# Altium schematic sheet DEBUG_UART_INTERFACE.SchDoc
size A4; SheetNumber: 19; SheetTotal: 27
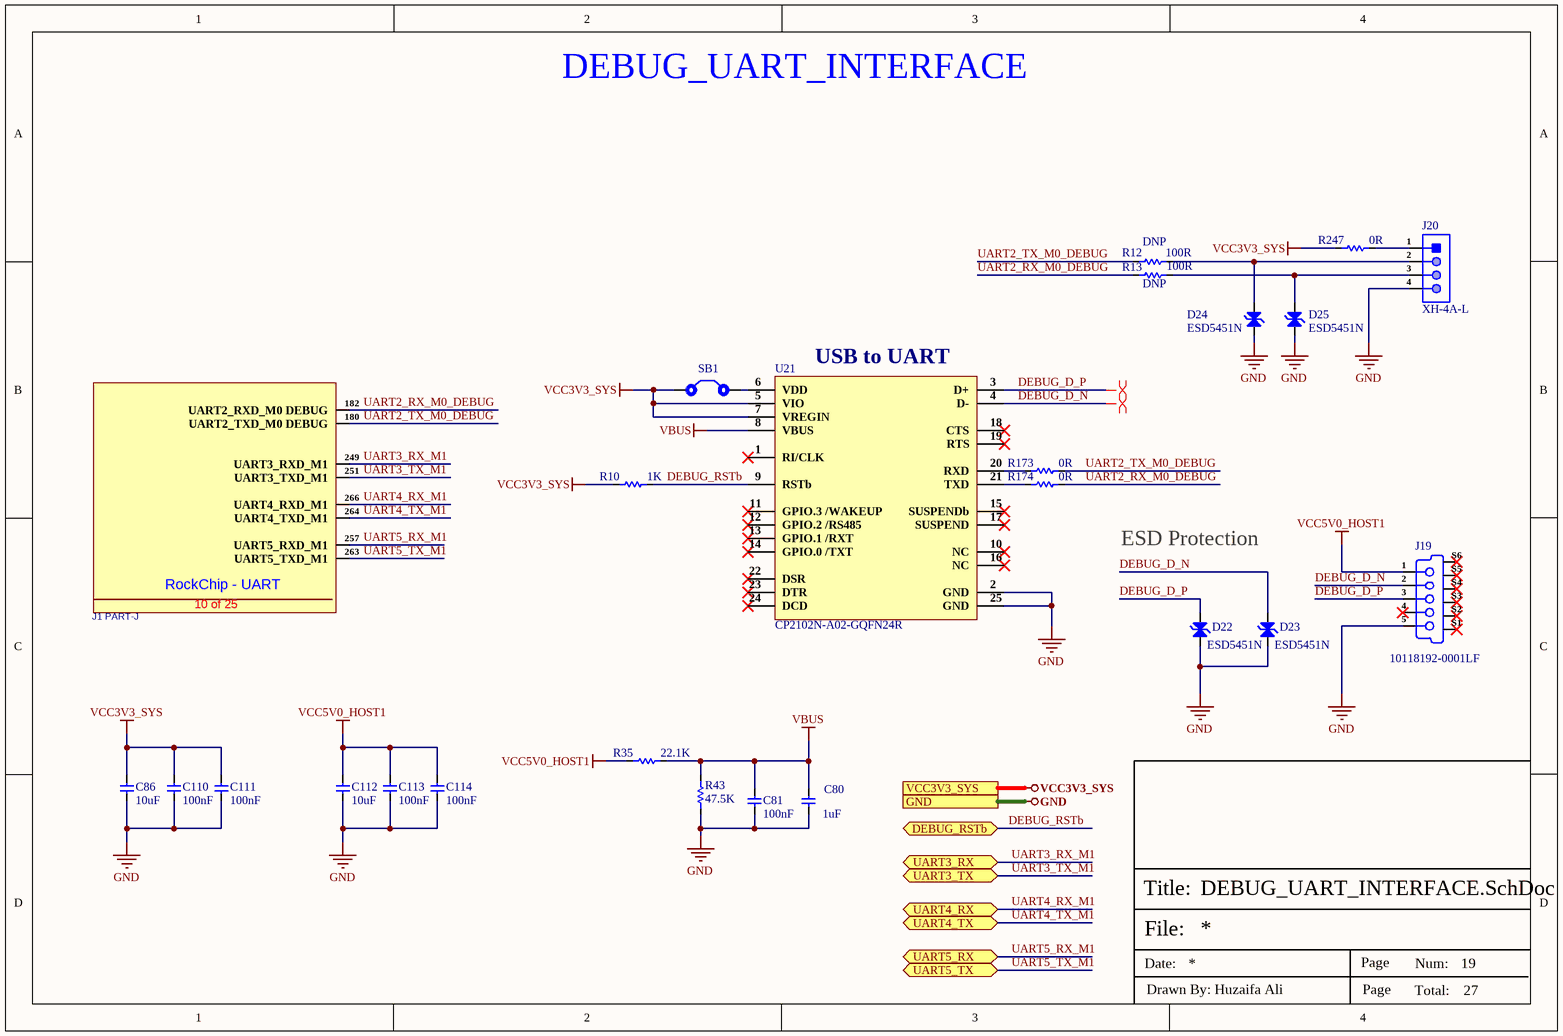
[diagram p0: DEBUG_UART_INTERFACE.SchDoc]

## Parts
C80  1uF  [Cap-0402]
C81  100nF  [Cap-0402]
C86  10uF  [Cap-0603]
C110  100nF  [Cap-0402]
C111  100nF  [Cap-0402]
C112  10uF  [Cap-0603]
C113  100nF  [Cap-0402]
C114  100nF  [Cap-0402]
D22  ESD5451N  [DFN1006-2L (Bi-Directional)]
D23  ESD5451N  [DFN1006-2L (Bi-Directional)]
D24  ESD5451N  [DFN1006-2L (Bi-Directional)]
D25  ESD5451N  [DFN1006-2L (Bi-Directional)]
J1_PART-  AS0B826-S78B-7H  [AS0B826-S78B-7H]  (value not drawn)  (part J of 25)
J19  10118192-0001LF  [10118192-0001LF_]
J20  XH-4A-L  [XH-4A-L]
R10  1K  [Res-0402]
R12  DNP  [Res-0402]
R13  DNP  [Res-0402]
R35  22.1K  [Res-0603]
R43  47.5K  [Res-0603]
R173  0R  [Res-0402]
R174  0R  [Res-0402]
R247  0R  [Res-0402]
SB1  Solder Bridge 0402  [Solder Bridge 0402]  (value not drawn)  (no BOM)
U21  CP2102N-A02-GQFN24R  [CP2102N-A02-GQFN24R]

## Ports
DEBUG_RSTb (bidir, see TOP SHEET[2D], ROCKCHIP_GPIO_NC PINS[3D]), GND (see TOP SHEET[2D], AUDIO_INTERFACE[1D], BUCK REGULATOR[3D], DIGITAL IO_RELAY_SHEET[5D], DUAL_SIM_INTERFACE[3D], ETHERNET_PHY0[4D], ETHERNET_PHY1[4D], GSM_INTERFACE[2D], HDMI_INTERFACE[3D], INPUT_PROTECTION[3D], LINEAR_VOLTAGE_REG[3D], MICRO_SD_INTERFACE[3D], MIPI-DSI DISPLAY[3D], POWER SECTION[3D], PUSH BUTTONs_INTERFACE[3C], RGB_LEDs_INTERFACE[3D], ROCKCHIP_PWR_SUPPLY[1D], ROCKCHIP_SYSTEM_CONTROL[3C], RS232_RS485_INTERFACE[3C], SENSOR_SHEET[3D], USB2.0_INTERFACE[3D], USB3.0_INTERFACE[3D], USB-C_INTERFACE[2D], WIEGAND_INTERFACE[3D], WIFI_BLUETOOTH_SHEET[4C]), UART3_RX (bidir, see TOP SHEET[2D], RS232_RS485_INTERFACE[3D]), UART3_TX (bidir, see TOP SHEET[2D], RS232_RS485_INTERFACE[3D]), UART4_RX (bidir, see TOP SHEET[2D], RS232_RS485_INTERFACE[3D]), UART4_TX (bidir, see TOP SHEET[2D], RS232_RS485_INTERFACE[3D]), UART5_RX (bidir, see TOP SHEET[2D], GSM_INTERFACE[3C]), UART5_TX (bidir, see TOP SHEET[2D], GSM_INTERFACE[3D]), VCC3V3_SYS (see TOP SHEET[2D], AUDIO_INTERFACE[1D], BUCK REGULATOR[3D], DIGITAL IO_RELAY_SHEET[5D], ETHERNET_PHY0[4D], ETHERNET_PHY1[4D], GSM_INTERFACE[2D], HDMI_INTERFACE[3D], LINEAR_VOLTAGE_REG[3D], MIPI-DSI DISPLAY[3D], POWER SECTION[3D], PUSH BUTTONs_INTERFACE[3C], ROCKCHIP_PWR_SUPPLY[1D], ROCKCHIP_SYSTEM_CONTROL[3C], RS232_RS485_INTERFACE[3C], SENSOR_SHEET[3D], USB-C_INTERFACE[2D], WIEGAND_INTERFACE[3D], WIFI_BLUETOOTH_SHEET[4C])

## Nets
GND: C80.2 C81.2 C86.1 C110.1 C111.1 C112.1 C113.1 C114.1 D22.1(K) D23.1(K) D24.1(K) D25.1(K) J19.5(GND) J20.4 R43.2 U21.2(GND) U21.25(GND) ; port GND
VBUS: C80.1 C81.1 R35.2 R43.1 U21.8(VBUS)
VCC3V3_SYS: C86.2 C110.2 C111.2 R10.1 R247.1 SB1.1 U21.5(VIO) U21.7(VREGIN) ; port VCC3V3_SYS
VCC5V0_HOST1: C112.2 C113.2 C114.2 J19.1(V_BUS_(5V)) R35.1
DEBUG_D_N: D23.2(K) J19.2(D-) U21.4(D-)
DEBUG_D_P: D22.2(K) J19.3(D+) U21.3(D+)
DEBUG_RSTb: R10.2 U21.9(RSTb) ; port DEBUG_RSTb
UART2_RX_M0_DEBUG: J1_PART-.182(UART2_RXD_M0_DEBUG) R13.1 R174.2
UART2_TX_M0_DEBUG: J1_PART-.180(UART2_TXD_M0_DEBUG) R12.1 R173.2
UART3_RX_M1: J1_PART-.249(UART3_RXD_M1) ; port UART3_RX
UART3_TX_M1: J1_PART-.251(UART3_TXD_M1) ; port UART3_TX
UART4_RX_M1: J1_PART-.266(UART4_RXD_M1) ; port UART4_RX
UART4_TX_M1: J1_PART-.264(UART4_TXD_M1) ; port UART4_TX
UART5_RX_M1: J1_PART-.257(UART5_RXD_M1) ; port UART5_RX
UART5_TX_M1: J1_PART-.263(UART5_TXD_M1) ; port UART5_TX
NetD24_2: D24.2(K) J20.2 R12.2
NetD25_2: D25.2(K) J20.3 R13.2
NetJ20_1: J20.1 R247.2
NetR173_1: R173.1 U21.20(RXD)
NetR174_1: R174.1 U21.21(TXD)
NetSB1_2: SB1.2 U21.6(VDD)

Not connected (* = marked no-connect by the designer): J19 4(NC)* S1(Shield)* S2(Shield)* S3(Shield)* S4(Shield)* S5(Shield)* S6(Shield)*; U21 1(RI/CLK)* 10(NC)* 11(GPIO.3_/WAKEUP)* 12(GPIO.2_/RS485)* 13(GPIO.1_/RXT)* 14(GPIO.0_/TXT)* 15(SUSPENDb)* 16(NC)* 17(SUSPEND)* 18(CTS)* 19(RTS)* 22(DSR)* 23(DTR)* 24(DCD)*

## Layout directives
differential pair; differential pair class D1_Lines; net class D1: DEBUG_D_P
differential pair; net class D1; differential pair class D1_Lines: DEBUG_D_N

## Notes on the sheet
- DEBUG_UART_INTERFACE
- (near R12) 100R
- 100R
- (near U21) USB to UART
- ESD Protection
- File:
- Title:
- Date:
- Page
- Num:
- Total:
- Drawn By: Huzaifa Ali
- (in symbol AS0B826-S78B-7H, part J) RockChip - UART; 10 of 25

## Library data of the parts
C80 = CC0402KRX5R8BB105: CAP CER 1UF 25V X5R 0402; Manufacturer: Yageo; Tolerance: 10%; Supplier 1: Mouser; Manufacturer Part Number: CC0402KRX5R8BB105; RoHS: Yes; Category: Ceramic Capacitors; Stock 1: 91975; Pricing 1: 1=0.30000, 10=0.20400, 50=0.20400, 100=0.11600, 1000=0.07200, 10000=0.05900 (USD); Mount: Surface Mount; Case/Package: 0402; Case Code (Metric): 1005; Case Code (Imperial): 0402; Min Operating Temperature: -55°C; Max Operating Temperature: 85°C; Capacitance: 1uF; Dielectric: X5R; Package Quantity: 10000; Voltage Rating: 25V; Packaging: Tape and Reel; Termination: SMD/SMT; Voltage Rating (DC): 25V; Length: 0.039inch; Width: 0.02inch; Thickness: 0.022inch; Lead Free: Lead Free; Halogen Free: Halogen Free; RoHS Compliant: Yes; ComponentLink1URL: http://www.mouser.com/ds/2/447/Yageo_UPY-GP_NP0_16V-to-50V_9-358835.pdf?src-supplier=Mouser; ComponentLink1Description: http://www.mouser.com/ds/2/447/Yageo_UPY-GP_NP0_16V-to-50V_9-358835.pdf?src-supplier=Mouser; ComponentLink2URL: http://www.yageo.com/documents/recent/UPY-GPHC_X5R_4V-to-50V_25.pdf?src-supplier=Digi-Key; ComponentLink2Description: http://www.yageo.com/documents/recent/UPY-GPHC_X5R_4V-to-50V_25.pdf?src-supplier=Digi-Key; ComponentLink3URL: https://4donline.ihs.com/images/VipMasterIC/IC/YAGO/YAGO-S-A0006851646/YAGO-S-A0006851646-1.pdf?hkey=6D3A4C79FDBF58556ACFDE234799DDF0&src-supplier=Newark; ComponentLink3Description: https://4donline.ihs.com/images/VipMasterIC/IC/YAGO/YAGO-S-A0006851646/YAGO-S-A0006851646-1.pdf?hkey=6D3A4C79FDBF58556ACFDE234799DDF0&src-supplier=Newark; Supplier Part Number 1: 603-CC402KRX5R8BB105; LCSC Part Number: C326568; Weight: 2.3E-05oz
C81 C110 C111 C113 C114 = CC0402KRX5R7BB104: CAP CER 0.1UF 16V X5R 0402; Manufacturer: Yageo; Tolerance: 10%; Manufacturer Part Number: CC0402KRX5R7BB104; RoHS: Yes; Category: Ceramic Capacitors; Supplier 1: Mouser; Stock 1: 936792; Pricing 1: 1=0.10000, 10=0.02300, 50=0.02300, 100=0.01100, 1000=0.00600, 10000=0.00400 (USD); Mount: Surface Mount; Case/Package: 0402; Number of Pins: 2; Case Code (Metric): 1005; Case Code (Imperial): 0402; Min Operating Temperature: -55°C; Max Operating Temperature: 85°C; Capacitance: 100nF; Dielectric: X5R; Packaging: Tape and Reel; Voltage Rating: 16V; Package Quantity: 1; Voltage Rating (DC): 16V; Termination: SMD/SMT; Resistor Type: Ceramic; Series: CC; Construction: Flat; Length: 1mm; Width: 0.02inch; Height: 0.5mm; Thickness: 0.022inch; Depth: 0.5mm; Radiation Hardening: No; REACH SVHC: Unknown; Lead Free: Lead Free; Halogen Free: Halogen Free; RoHS Compliant: Yes; ComponentLink1URL: https://datasheet.ciiva.com/155/mlccorderingcode-155879.pdf?src-supplier=Digi-Key; ComponentLink1Description: https://datasheet.ciiva.com/155/mlccorderingcode-155879.pdf?src-supplier=Digi-Key; ComponentLink2URL: https://datasheet.ciiva.com/155/mlccorderingcode-155878.pdf?src-supplier=Digi-Key; ComponentLink2Description: https://datasheet.ciiva.com/155/mlccorderingcode-155878.pdf?src-supplier=Digi-Key; ComponentLink3URL: https://datasheet.ciiva.com/155/mlccorderingcode-155880.pdf?src-supplier=Digi-Key; ComponentLink3Description: https://datasheet.ciiva.com/155/mlccorderingcode-155880.pdf?src-supplier=Digi-Key; ComponentLink4URL: https://datasheet.ciiva.com/11464/upy-gphc-x5r-4v-to-50v-12-11464869.pdf?src-supplier=Avnet; ComponentLink4Description: https://datasheet.ciiva.com/11464/upy-gphc-x5r-4v-to-50v-12-11464869.pdf?src-supplier=Avnet; Supplier Part Number 1: 603-CC402KRX5R7BB104; LCSC Part Number: C106204
C86 C112 = C1608X5R1E106M080AC: CAP CER 10UF 25V X5R 0603; Manufacturer: TDK; Tolerance: 20%; Dielectric Material: Ceramic; Item Type: Capacitor; Manufacturer Part Number: C1608X5R1E106M080AC; Supplier 1: Digi-Key; Stock 1: 61681; Pricing 1: 1=0.96, 10=0.704, 100=0.483, 500=0.38238, 1000=0.322 (USD); Mount: Surface Mount; Case/Package: 0603; Case Code (Metric): 1608; Case Code (Imperial): 0603; Min Operating Temperature: -55°C; Max Operating Temperature: 85°C; Capacitance: 10uF; Dielectric: X5R; Packaging: Tape and Reel; Voltage Rating: 25V; Package Quantity: 1; Voltage Rating (DC): 25V; Termination: SMD/SMT; Length: 1.6mm; Width: 0.8mm; Height: 0.8mm; Thickness: 0.039inch; Depth: 0.8mm; REACH SVHC: No SVHC; Lead Free: Lead Free; Supplier Part Number 1: 445-9015-1-ND; LCSC Part Number: C2168289; Weight: 7.1E-05oz; Composition: Ceramic
D22-D25 = ESD5451N: DFN1006-2(0402) ESD Protection Devices ROHS; Manufacturer: TECH PUBLIC; Manufacturer Part Number: ESD5451N; Footprint: DFN1006-2(0402); ComponentLink1Description: LCSC; ComponentLink1URL: https://www.lcsc.com/product-detail/span-style-background-color-ff0-ESD-span-Protection-Devices_TECH-PUBLIC-ESD5451N_C2936977.html; LCSC Part Number: C2936977
J1_PART- = AS0B826-S78B-7H: SMD,P=0.5mm,Surface Mount，Right Angle; Manufacturer: FOXCONN; Item Type: Card Edge Connectors; Supplier: LCSC; Manufacturer Part Number: AS0B826-S78B-7H; RoHS: No; Stock: 4979; Pricing: 1=9.21, 10=8.287, 25=7.8064, 50=7.6064, 100=7.4062 (USD); LCSC Part Number: C426232
J19 = 10118192-0001LF: CONN RCPT USB2.0 MICRO B SMD R/A; Manufacturer: Amphenol FCI; Gender: Receptacle; Current Rating: 1.8A; Connector Type: USB,Receptacle; Number of Contacts: 5; Number of Ports: 1; Insulation Resistance: 1GR; Max Voltage Rating (AC): 100V; Pitch: 0.65mm; Item Type: USB Connector; Supplier 1: Digi-Key; Manufacturer Part Number: 10118192-0001LF; Stock 1: 32977; Pricing 1: 1=0.43, 10=0.405, 25=0.3648, 50=0.3242, 100=0.3107, 250=0.28368, 500=0.27016 (USD); Mount: Surface Mount,Horizontal; Contact Plating: Gold; Contact Material: Copper Alloy; Color: Black; Number of Terminals: 5; Housing Material: Polymer; Min Operating Temperature: -55°C; Max Operating Temperature: 85°C; Termination: Solder; Packaging: Tape and Reel; Orientation: Right Angle; Package Quantity: 1400; Features: Shielded; Voltage Rating: 100V; USB Standard: USB 2.0; Length: 7.86mm; Depth: 5.57mm; Radiation Hardening: No; Flammability Rating: UL94 V-0; Lead Free: Lead Free; REACH SVHC: No SVHC; ComponentLink1URL: https://cdn.amphenol-icc.com/media/wysiwyg/files/documentation/datasheet/inputoutput/io_usb_micro.pdf?src-supplier=Verical; ComponentLink1Description: https://cdn.amphenol-icc.com/media/wysiwyg/files/documentation/datasheet/inputoutput/io_usb_micro.pdf?src-supplier=Verical; ComponentLink2URL: http://www.amphenol-icc.com/media/wysiwyg/files/drawing/10118192.pdf?src-supplier=Digi-Key; ComponentLink2Description: http://www.amphenol-icc.com/media/wysiwyg/files/drawing/10118192.pdf?src-supplier=Digi-Key; ComponentLink3URL: https://cdn.amphenol-icc.com/media/wysiwyg/files/documentation/datasheet/inputoutput/io_usb_micro.pdf?src-supplier=Mouser; ComponentLink3Description: https://cdn.amphenol-icc.com/media/wysiwyg/files/documentation/datasheet/inputoutput/io_usb_micro.pdf?src-supplier=Mouser; Supplier Part Number 1: 609-4613-6-ND; LCSC Part Number: C132564
J20 = XH-4A-L: 1x4P 4P XH 1 Tin 2.5mm 4 -25℃~+85℃ Brass 3A Straight Plugin,P=2.5mm Wire To Board Connector ROHS; Manufacturer: HCTL; Manufacturer Part Number: XH-4A-L; Package: Plugin,P=2.5mm; LCSC Part Number: C2979569; Item Type: Wire To Board Connector; ComponentLink1Description: LCSC; ComponentLink1URL: https://www.lcsc.com/product-detail/Wire-To-Board-Connector_HCTL-XH-4A-L_C2979569.html
R10 = RC0402FR-071KL: RES 1K OHM 1% 1/16W 0402; Manufacturer: Yageo; Resistance: 1kR; Temperature Coefficient: 100ppm/°C; Voltage Rating (DC): 50V; Power Rating: 62.5mW; Max Power Dissipation: 63mW; Item Type: Resistor; Supplier 1: Avnet; Manufacturer Part Number: RC0402FR-071KL; RoHS: Yes; Category: Chip SMD Resistors; Stock 1: 13030000; Pricing 1: 10000=0.00085, 20000=0.00087, 40000=0.00084, 60000=0.00083, 80000=0.00079, 100000=0.00078, 1000000=0.00076 (USD); Case/Package: 0402; Number of Pins: 2; Case Code (Imperial): 0402; Case Code (Metric): 1005; Size Code: 0402; Min Operating Temperature: -55°C; Max Operating Temperature: 155°C; Resistor Type: Thick Film; Tolerance: 1%; Packaging: Tape and Reel; Voltage Rating: 50V; Termination: SMD/SMT; Features: Moisture Resistant; Series: RC; Number of Terminations: 2; Resistance Tolerance: 1%; Construction: Rectangular; Technology: THICK FILM; Length: 1mm; Width: 0.5mm; Height: 0.32mm; Depth: 0.5mm; Reach SVHC Compliant: Yes; Lead Free: Lead Free; RoHS Compliant: Yes; Military Standard: Not; ComponentLink1URL: https://datasheet.ciiva.com/11819/0900766b80c66297-11819477.pdf?src-supplier=RSComponents; ComponentLink1Description: https://datasheet.ciiva.com/11819/0900766b80c66297-11819477.pdf?src-supplier=RSComponents; ComponentLink2URL: https://datasheet.ciiva.com/7983/1018594-7983502.pdf?src-supplier=Element14; ComponentLink2Description: https://datasheet.ciiva.com/7983/1018594-7983502.pdf?src-supplier=Element14; ComponentLink3URL: https://datasheet.ciiva.com/22747/1018594-22747513.pdf?src-supplier=Element14; ComponentLink3Description: https://datasheet.ciiva.com/22747/1018594-22747513.pdf?src-supplier=Element14; ComponentLink4URL: https://datasheet.ciiva.com/12666/pyu-rc0402-51-rohs-l-6-r-12666741.pdf?src-supplier=Mouser; ComponentLink4Description: https://datasheet.ciiva.com/12666/pyu-rc0402-51-rohs-l-6-r-12666741.pdf?src-supplier=Mouser; ComponentLink5URL: https://datasheet.ciiva.com/7849/1018594-7849869.pdf?src-supplier=Element14; ComponentLink5Description: https://datasheet.ciiva.com/7849/1018594-7849869.pdf?src-supplier=Element14; ComponentLink6URL: https://datasheet.ciiva.com/7849/1018594-7849871.pdf?src-supplier=Element14; ComponentLink6Description: https://datasheet.ciiva.com/7849/1018594-7849871.pdf?src-supplier=Element14; ComponentLink7URL: https://datasheet.ciiva.com/17063/pyu-rc0402-51-rohs-l-6-r-17063193.pdf?src-supplier=Future+Electronics; ComponentLink7Description: https://datasheet.ciiva.com/17063/pyu-rc0402-51-rohs-l-6-r-17063193.pdf?src-supplier=Future+Electronics; Supplier Part Number 1: RC0402FR-071KL; LCSC Part Number: C106235
R12 R13 = RC0402FR-07100RL: RES 100 OHM 1% 1/16W 0402; Manufacturer: Yageo; Power Rating: 62.5mW; Voltage Rating: 50V; Resistance: 100R; Temperature Coefficient: 100ppm/°C; Max Power Dissipation: 63mW; Item Type: Resistor; Supplier 1: Mouser; Manufacturer Part Number: RC0402FR-07100RL; RoHS: Yes; Category: Chip SMD Resistors; Stock 1: 699545; Pricing 1: 1=0.10000, 10=0.01200, 50=0.01200, 100=0.00500, 1000=0.00300, 2500=0.00200, 10000=0.00100 (USD); Case/Package: 0402; Number of Pins: 2; Case Code (Imperial): 0402; Case Code (Metric): 1005; Size Code: 0402; Min Operating Temperature: -55°C; Max Operating Temperature: 155°C; Tolerance: 1%; Voltage Rating (DC): 50V; Packaging: Tape and Reel; Termination: SMD/SMT; Resistor Type: Thick Film; Features: Moisture Resistant; Series: RC; Number of Terminations: 2; Resistance Tolerance: 1%; Construction: Rectangular; Technology: THICK FILM; Length: 1mm; Width: 0.5mm; Height: 0.32mm; Depth: 0.5mm; RoHS Compliant: Yes; REACH SVHC: No SVHC; Military Standard: Not; Lead Free: Lead Free; ComponentLink1URL: https://datasheet.ciiva.com/11808/0900766b80c66297-11808765.pdf?src-supplier=RSComponents; ComponentLink1Description: https://datasheet.ciiva.com/11808/0900766b80c66297-11808765.pdf?src-supplier=RSComponents; ComponentLink2URL: https://datasheet.ciiva.com/7849/1784430-7849810.pdf?src-supplier=Element14; ComponentLink2Description: https://datasheet.ciiva.com/7849/1784430-7849810.pdf?src-supplier=Element14; ComponentLink3URL: https://datasheet.ciiva.com/28367/1018594-28367226.pdf?src-supplier=Element14; ComponentLink3Description: https://datasheet.ciiva.com/28367/1018594-28367226.pdf?src-supplier=Element14; ComponentLink4URL: https://datasheet.ciiva.com/22747/1018594-22747511.pdf?src-supplier=Element14; ComponentLink4Description: https://datasheet.ciiva.com/22747/1018594-22747511.pdf?src-supplier=Element14; ComponentLink5URL: https://datasheet.ciiva.com/12667/pyu-rc0402-51-rohs-l-6-r-12667957.pdf?src-supplier=Mouser; ComponentLink5Description: https://datasheet.ciiva.com/12667/pyu-rc0402-51-rohs-l-6-r-12667957.pdf?src-supplier=Mouser; ComponentLink6URL: https://datasheet.ciiva.com/15189/getdatasheetpartid-329466-15189335.pdf?src-supplier=Verical; ComponentLink6Description: https://datasheet.ciiva.com/15189/getdatasheetpartid-329466-15189335.pdf?src-supplier=Verical; ComponentLink7URL: https://datasheet.ciiva.com/16740/pyu-rc0402-51-rohs-l-6-r-16740566.pdf?src-supplier=Future+Electronics; ComponentLink7Description: https://datasheet.ciiva.com/16740/pyu-rc0402-51-rohs-l-6-r-16740566.pdf?src-supplier=Future+Electronics; Supplier Part Number 1: 603-RC0402FR-07100RL; LCSC Part Number: C106232
R35 = RC0603FR-0722K1L: RES 22.1K OHM 1% 1/10W 0603; Manufacturer: Yageo; Power Rating: 100mW; Resistance: 22.1kR; Voltage Rating: 50V; Temperature Coefficient: 100ppm/°C; Item Type: Resistor; Supplier 1: Avnet; Manufacturer Part Number: RC0603FR-0722K1L; RoHS: Yes; Category: Chip SMD Resistors; Stock 1: 595000; Pricing 1: 5000=0.00133, 10000=0.00131, 20000=0.00127 (USD); Case/Package: 0603; Case Code (Imperial): 0603; Case Code (Metric): 1608; Size Code: 0603; Min Operating Temperature: -55°C; Max Operating Temperature: 155°C; Tolerance: 1%; Package Quantity: 5000; Packaging: Tape and Reel; Termination: SMD/SMT; Voltage Rating (DC): 50V; Series: RC; Length: 1.6mm; Width: 0.8mm; Height: 0.45mm; Lead Free: Lead Free; RoHS Compliant: Yes; ComponentLink1URL: https://datasheet.ciiva.com/12555/rc0603-272842-12555287.pdf?src-supplier=Mouser; ComponentLink1Description: https://datasheet.ciiva.com/12555/rc0603-272842-12555287.pdf?src-supplier=Mouser; Supplier Part Number 1: RC0603FR-0722K1L; LCSC Part Number: C137768
R43 = RC0603FR-0747K5L: RES 47.5K OHM 1% 1/10W 0603; Manufacturer: Yageo; Resistance: 47.5kR; Power Rating: 100mW; Voltage Rating: 50V; Temperature Coefficient: 100ppm/°C; Item Type: Resistor; Supplier 1: Avnet; Manufacturer Part Number: RC0603FR-0747K5L; RoHS: Yes; Category: Chip SMD Resistors; Stock 1: 20000; Pricing 1: 5000=0.00133, 10000=0.00131, 20000=0.00127 (USD); Case/Package: 0603; Number of Pins: 2; Case Code (Metric): 1608; Case Code (Imperial): 0603; Size Code: 0603; Min Operating Temperature: -55°C; Max Operating Temperature: 155°C; Tolerance: 1%; Package Quantity: 5000; Packaging: Tape and Reel; Resistor Type: Thick Film; Number of Terminations: 2; Termination: SMD/SMT; Max Power Dissipation: 100mW; Voltage Rating (DC): 50V; Features: Moisture Resistant; Series: RC; Technology: THICK FILM; Construction: Rectangular; Resistance Tolerance: 1%; Length: 1.6mm; Width: 0.031inch; Height: 0.45mm; Depth: 0.8mm; RoHS Compliant: Yes; Reach SVHC Compliant: Yes; Military Standard: Not; Lead Free: Lead Free; ComponentLink1URL: https://datasheet.ciiva.com/11808/0900766b80f96399-11808343.pdf?src-supplier=RSComponents; ComponentLink1Description: https://datasheet.ciiva.com/11808/0900766b80f96399-11808343.pdf?src-supplier=RSComponents; ComponentLink2URL: https://datasheet.ciiva.com/2454/pyu-r-int-thick-7-2454790.pdf?src-supplier=Digi-Key; ComponentLink2Description: https://datasheet.ciiva.com/2454/pyu-r-int-thick-7-2454790.pdf?src-supplier=Digi-Key; ComponentLink3URL: https://datasheet.ciiva.com/2454/pyu-r-int-thick-7-2454791.pdf?src-supplier=Digi-Key; ComponentLink3Description: https://datasheet.ciiva.com/2454/pyu-r-int-thick-7-2454791.pdf?src-supplier=Digi-Key; ComponentLink4URL: https://datasheet.ciiva.com/2454/pyu-r-int-thick-7-2454789.pdf?src-supplier=Digi-Key; ComponentLink4Description: https://datasheet.ciiva.com/2454/pyu-r-int-thick-7-2454789.pdf?src-supplier=Digi-Key; ComponentLink5URL: https://datasheet.ciiva.com/12555/rc0603-272842-12555285.pdf?src-supplier=Mouser; ComponentLink5Description: https://datasheet.ciiva.com/12555/rc0603-272842-12555285.pdf?src-supplier=Mouser; ComponentLink6URL: https://datasheet.ciiva.com/15189/getdatasheetpartid-135115-15189741.pdf?src-supplier=Verical; ComponentLink6Description: https://datasheet.ciiva.com/15189/getdatasheetpartid-135115-15189741.pdf?src-supplier=Verical; Supplier Part Number 1: RC0603FR-0747K5L; LCSC Part Number: C137715
R173 R174 R247 = RC0402FR-070RL: RES 0 OHM JUMPER 1/16W 0402; Manufacturer: Yageo; Tolerance: 1%; Power Rating: 62.5mW; Voltage Rating: 50V; Temperature Coefficient: 200ppm/°C; Max Power Dissipation: 63mW; Supplier 1: Mouser; Manufacturer Part Number: RC0402FR-070RL; RoHS: Yes; Category: Chip SMD Resistors; Stock 1: 8556842; Pricing 1: 1=0.10000, 10=0.01400, 50=0.01400, 100=0.00600, 1000=0.00300, 5000=0.00200, 10000=0.00100 (USD); Mount: Surface Mount; Case/Package: 0402; Contact Plating: Tin,Matte; Case Code (Imperial): 0402; Case Code (Metric): 1005; Size Code: 0402; Min Operating Temperature: -55°C; Max Operating Temperature: 155°C; Resistance: 0R; Resistor Type: Thick Film; Packaging: Tape and Reel; Termination: SMD/SMT; Features: Moisture Resistant; Series: RC; Number of Terminations: 2; Length: 1mm; Width: 0.5mm; Height: 0.35mm; Radiation Hardening: No; Lead Free: Lead Free; RoHS Compliant: Yes; ComponentLink1URL: https://datasheet.ciiva.com/8896/pyu-rc0402-51-rohs-l-6-8896149.pdf?src-supplier=Avnet; ComponentLink1Description: https://datasheet.ciiva.com/8896/pyu-rc0402-51-rohs-l-6-8896149.pdf?src-supplier=Avnet; ComponentLink2URL: https://datasheet.ciiva.com/16790/pyu-rc0402-51-rohs-l-6-r-16790444.pdf?src-supplier=Future+Electronics; ComponentLink2Description: https://datasheet.ciiva.com/16790/pyu-rc0402-51-rohs-l-6-r-16790444.pdf?src-supplier=Future+Electronics; Supplier Part Number 1: 603-RC0402FR-070RL; LCSC Part Number: C106231
SB1 = Solder Bridge 0402: Solder Bridge ON; Manufacturer Part Number: Solder Bridge 0402; Item Type: Solder Bridge
U21 = CP2102N-A02-GQFN24R: IC USB TO UART BRIDGE QFN24; Manufacturer: Silicon Labs; Supplier 1: Digi-Key; Manufacturer Part Number: CP2102N-A02-GQFN24R; RoHS: Yes; Category: Interface ICs; Pricing 1: 1=1.56000 (USD); Supplier Part Number 1: 336-5888-1-ND